# EAGLE design Wobbler-R2 (EAGLE 7.7.0)
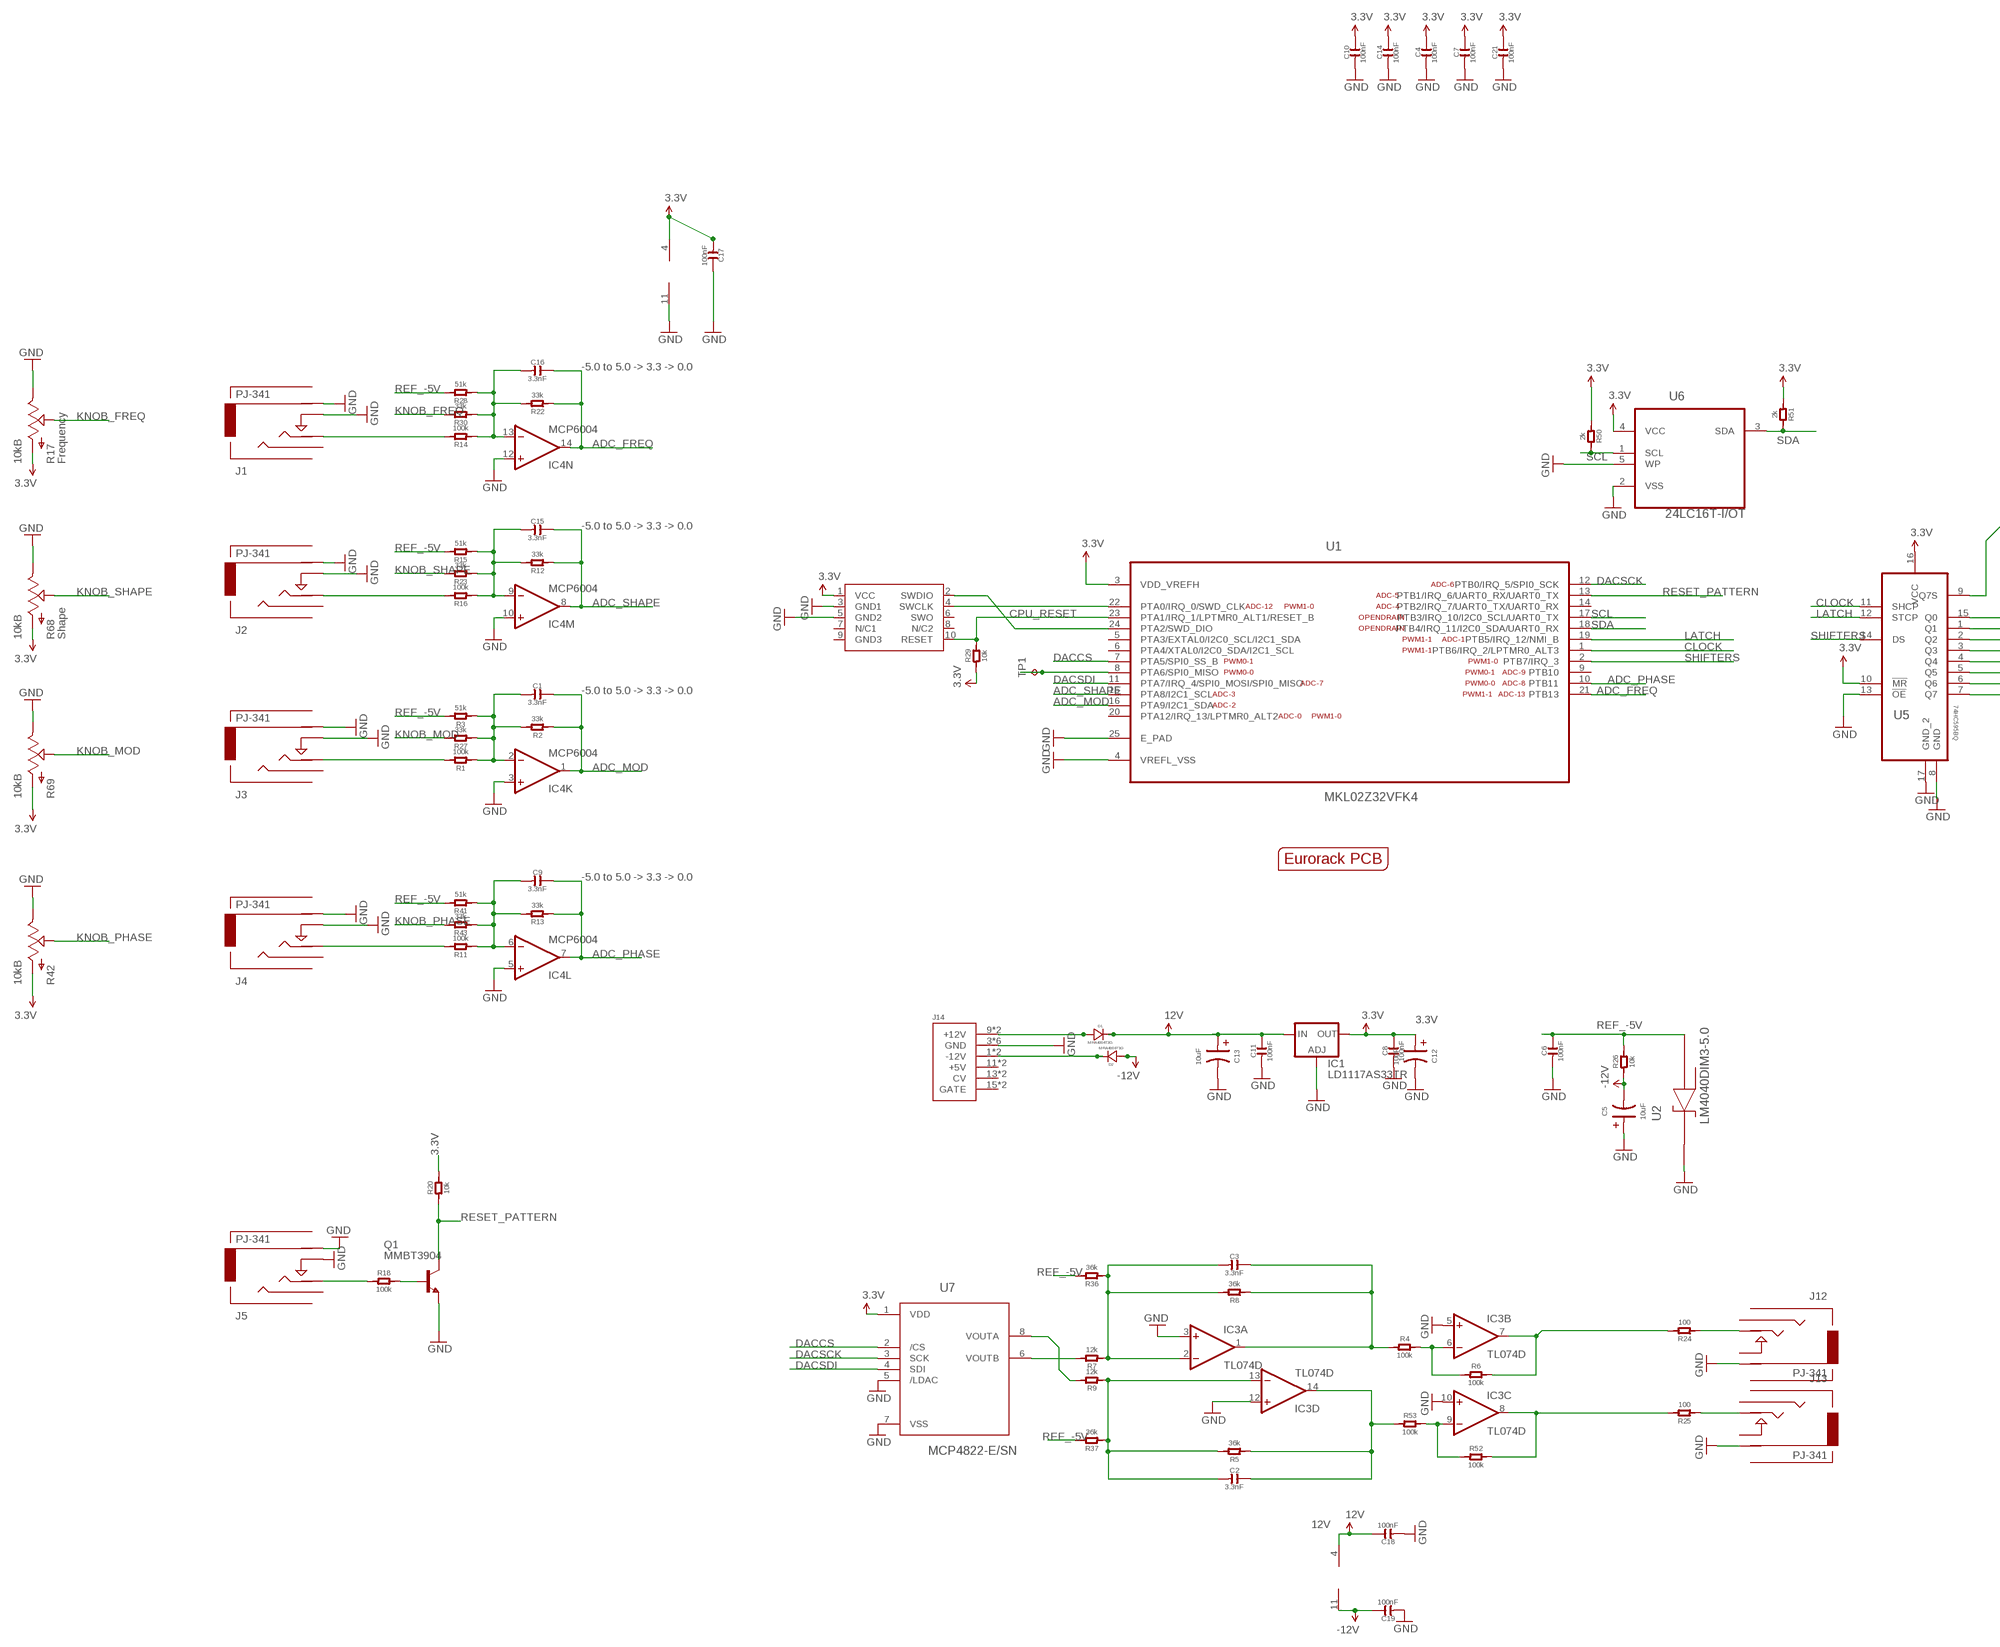
[diagram p0: schematic, sheet 1, part 1 of 2]
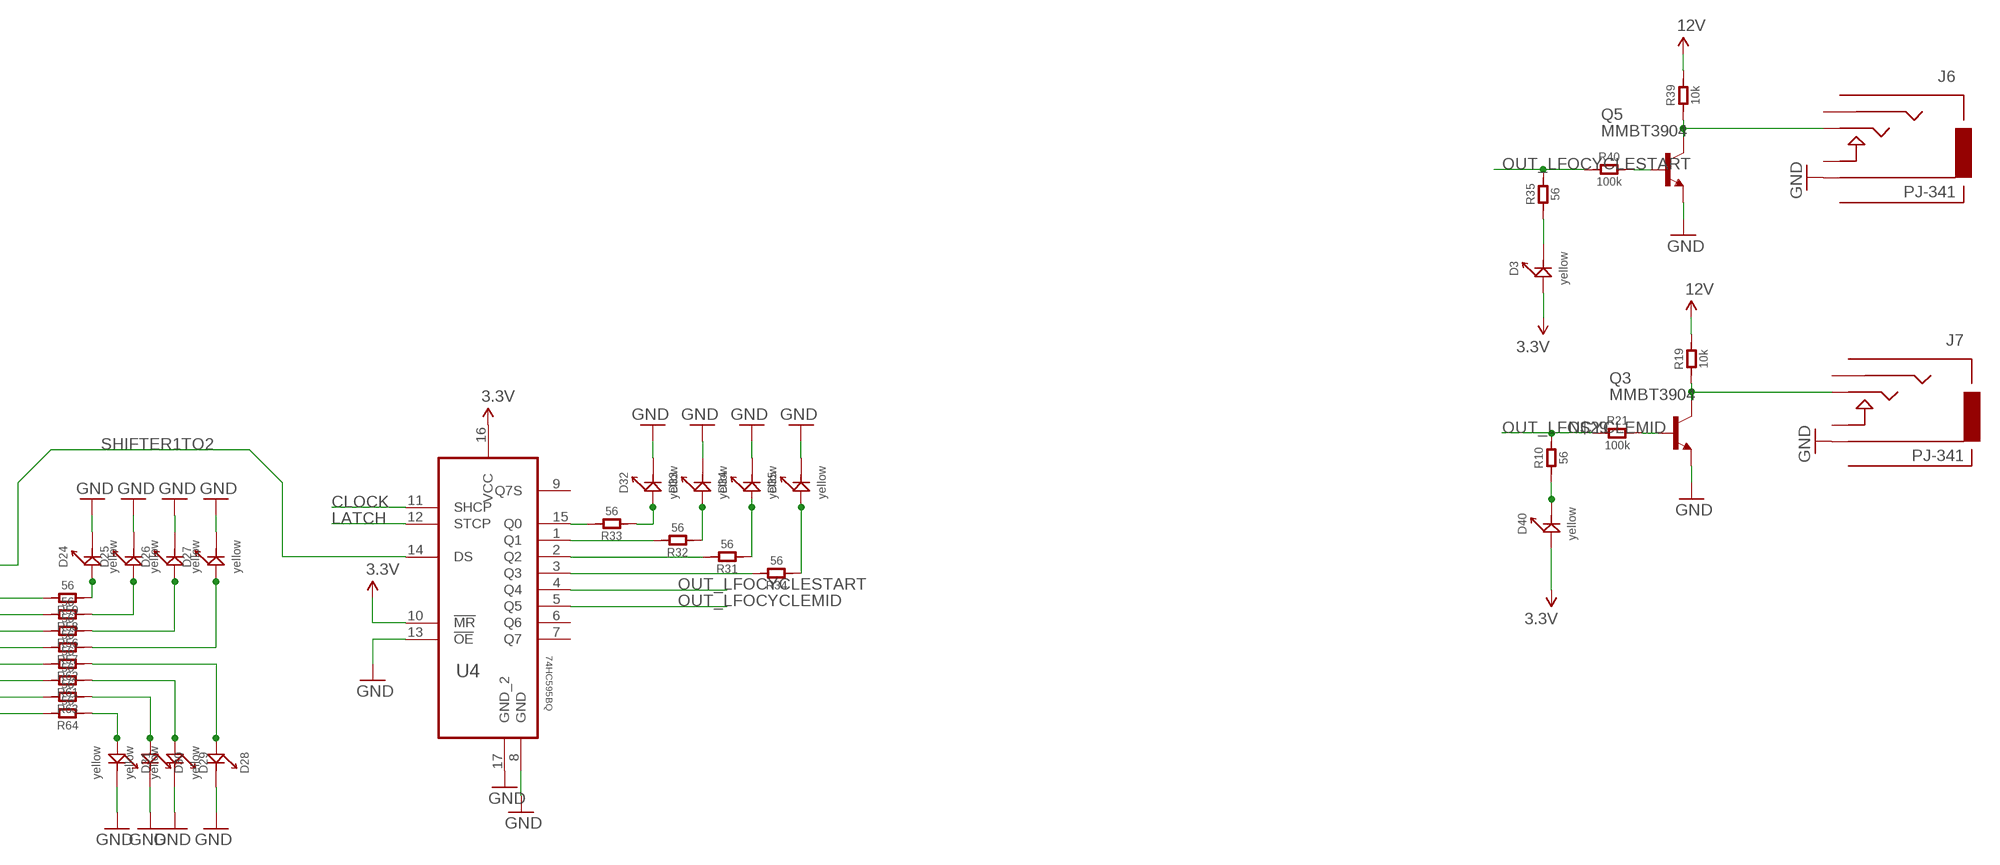
[diagram p1: schematic, sheet 1, part 2 of 2]

## Parts
C1  3.3nF  C-0603  [C0603]
C2  3.3nF  C-0603  [C0603]
C3  3.3nF  C-0603  [C0603]
C4  100nF  C-0603  [C0603]
C5  10uF  C-POLAR-A  [AVX-A]
C6  100nF  C-0603  [C0603]
C7  100nF  C-0603  [C0603]
C8  100nF  C-0603  [C0603]
C9  3.3nF  C-0603  [C0603]
C10  100nF  C-0603  [C0603]
C11  100nF  C-0603  [C0603]
C12  10uF  C-POLAR-A  [AVX-A]
C13  10uF  C-POLAR-A  [AVX-A]
C14  100nF  C-0603  [C0603]
C15  3.3nF  C-0603  [C0603]
C16  3.3nF  C-0603  [C0603]
C17  100nF  C-0603  [C0603]
C18  100nF  C-0603  [C0603]
C19  100nF  C-0603  [C0603]
C21  100nF  C-0603  [C0603]
D1  MRA4004T3G  D-SMA  [DO-214AC]
D2  MRA4004T3G  D-SMA  [DO-214AC]
D3  yellow  LED  [LED0603]
D24  yellow  LED  [LED0603]
D25  yellow  LED  [LED0603]
D26  yellow  LED  [LED0603]
D27  yellow  LED  [LED0603]
D28  yellow  LED  [LED0603]
D29  yellow  LED  [LED0603]
D30  yellow  LED  [LED0603]
D31  yellow  LED  [LED0603]
D32  yellow  LED  [LED0603]
D33  yellow  LED  [LED0603]
D34  yellow  LED  [LED0603]
D35  yellow  LED  [LED0603]
D40  yellow  LED  [LED0603]
IC1  LD1117AS33TR  [SOT223]
IC3  TL074D  [SO14]
IC4  MCP6004  [SO14]
J1  PJ-341  AUDIO-JACKINPUT  [3.5MM-JACK-SWITCH-13MM-INPUT]
J2  PJ-341  AUDIO-JACKINPUT  [3.5MM-JACK-SWITCH-13MM-INPUT]
J3  PJ-341  AUDIO-JACKINPUT  [3.5MM-JACK-SWITCH-13MM-INPUT]
J4  PJ-341  AUDIO-JACKINPUT  [3.5MM-JACK-SWITCH-13MM-INPUT]
J5  PJ-341  AUDIO-JACKINPUT  [3.5MM-JACK-SWITCH-13MM-INPUT]
J6  PJ-341  AUDIO-JACKOUTPUT  [3.5MM-JACK-SWITCH-13MM-OUTPUT]
J7  PJ-341  AUDIO-JACKOUTPUT  [3.5MM-JACK-SWITCH-13MM-OUTPUT]
J12  PJ-341  AUDIO-JACKOUTPUT  [3.5MM-JACK-SWITCH-13MM-OUTPUT]
J13  PJ-341  AUDIO-JACKOUTPUT  [3.5MM-JACK-SWITCH-13MM-OUTPUT]
J14  POWER  [POWER_16]
OUTLINE  EURORACK_PCB8HP  [EURORACK8HPPCB]
Q1  MMBT3904  MMBT3904LT1-NPN-SOT23-BEC  [SOT23-BEC]
Q3  MMBT3904  MMBT3904LT1-NPN-SOT23-BEC  [SOT23-BEC]
Q5  MMBT3904  MMBT3904LT1-NPN-SOT23-BEC  [SOT23-BEC]
R1  100k  R-0603  [R0603]
R2  33k  R-0603  [R0603]
R3  51k  R-0603  [R0603]
R4  100k  R-0603  [R0603]
R5  36k  R-0603  [R0603]
R6  100k  R-0603  [R0603]
R7  12k  R-0603  [R0603]
R8  36k  R-0603  [R0603]
R9  12k  R-0603  [R0603]
R10  56  R-0603  [R0603]
R11  100k  R-0603  [R0603]
R12  33k  R-0603  [R0603]
R13  33k  R-0603  [R0603]
R14  100k  R-0603  [R0603]
R15  51k  R-0603  [R0603]
R16  100k  R-0603  [R0603]
R17  10kB  POTZEPHPOT  [OG-POTS_ALPS_POT_VERTICAL]
R18  100k  R-0603  [R0603]
R19  10k  R-0603  [R0603]
R20  10k  R-0603  [R0603]
R21  100k  R-0603  [R0603]
R22  33k  R-0603  [R0603]
R23  33k  R-0603  [R0603]
R24  100  R-0603  [R0603]
R25  100  R-0603  [R0603]
R26  10k  R-0603  [R0603]
R27  33k  R-0603  [R0603]
R28  51k  R-0603  [R0603]
R29  10k  R-0603  [R0603]
R30  33k  R-0603  [R0603]
R31  56  R-0603  [R0603]
R32  56  R-0603  [R0603]
R33  56  R-0603  [R0603]
R34  56  R-0603  [R0603]
R35  56  R-0603  [R0603]
R36  36k  R-0603  [R0603]
R37  36k  R-0603  [R0603]
R39  10k  R-0603  [R0603]
R40  100k  R-0603  [R0603]
R41  51k  R-0603  [R0603]
R42  10kB  POTZEPHPOT  [OG-POTS_ALPS_POT_VERTICAL]
R43  33k  R-0603  [R0603]
R50  2k  R-0603  [R0603]
R51  2k  R-0603  [R0603]
R52  100k  R-0603  [R0603]
R53  100k  R-0603  [R0603]
R56  56  R-0603  [R0603]
R57  56  R-0603  [R0603]
R58  56  R-0603  [R0603]
R59  56  R-0603  [R0603]
R61  56  R-0603  [R0603]
R62  56  R-0603  [R0603]
R63  56  R-0603  [R0603]
R64  56  R-0603  [R0603]
R68  10kB  POTZEPHPOT  [OG-POTS_ALPS_POT_VERTICAL]
R69  10kB  POTZEPHPOT  [OG-POTS_ALPS_POT_VERTICAL]
SWD1  CORTEX_SWD  [M50-3600542]
TP1  TPB1,27  [B1,27]
U1  MKL02Z32VFK4  [QFN50P400X400X100-25N]
U2  LM4040DIM3-5.0  [SOT95P237X112-3N]
U4  74HC595BQ  [QFN50P250X350X100-17N]
U5  74HC595BQ  [QFN50P250X350X100-17N]
U6  24LC16T-I/OT  24LC00T-I/OT  [SOT95P290X145-5N]
U7  MCP4822-E/SN  [SOIC8-N_MC]

## Nets
3.3V [mediumpower]: C4.2 C7.2 C8.2 C10.2 C12.+ C14.2 C17.1 C21.2 D3.+ D40.+ IC1.2(OUT) IC1.4(OUT) IC4.4(O:V+) R17.P$3(A) R20.2 R29.1 R42.P$3(A) R50.1 R51.1 R68.P$3(A) R69.P$3(A) SWD1.1(VCC) U1.3(VDD_VREFH) U4.10(!MR) U4.16(VCC) U5.10(!MR) U5.16(VCC) U6.4(VCC) U7.1(VDD)
12V [heavypower]: C11.2 C13.+ C18.2 D1.2(-) IC1.3(IN) IC3.4(P:V+) R19.2 R39.2
-12V [heavypower]: C5.- C19.2 D2.1(+) IC3.11(P:V-) R26.1
ADC_FREQ: C16.2 IC4.14(N:OUT) R22.1 U1.21(PTB13)
ADC_MOD: C1.2 IC4.1(K:OUT) R2.1 U1.16(PTA9/I2C1_SDA)
ADC_PHASE: C9.2 IC4.7(L:OUT) R13.1 U1.10(PTB11)
ADC_SHAPE: C15.2 IC4.8(M:OUT) R12.1 U1.15(PTA8/I2C1_SCL)
CLOCK: U1.1(PTB6/IRQ_2/LPTMR0_ALT3) U4.11(SHCP) U5.11(SHCP)
CPU_RESET: R29.2 SWD1.10(RESET) U1.23(PTA1/IRQ_1/LPTMR0_ALT1/RESET_B)
DACCS: U1.7(PTA5/SPI0_SS_B) U7.2(/CS)
DACSCK: U1.12(PTB0/IRQ_5/SPI0_SCK) U7.3(SCK)
DACSDI: U1.11(PTA7/IRQ_4/SPI0_MOSI/SPI0_MISO) U7.4(SDI)
GND [groundplane]: C4.1 C5.+ C6.1 C7.1 C8.1 C10.1 C11.1 C12.- C13.- C14.1 C17.2 C18.1 C19.1 C21.1 D24.- D25.- D26.- D27.- D28.- D29.- D30.- D31.- D32.- D33.- D34.- D35.- IC1.1(ADJ) IC3.3(A:+IN) IC3.5(B:+IN) IC3.10(C:+IN) IC3.12(D:+IN) IC4.3(K:+IN) IC4.5(L:+IN) IC4.10(M:+IN) IC4.11(O:V-) IC4.12(N:+IN) J1.RING@3(RING) J1.SWITCH@3(SWITCH) J2.RING@3(RING) J2.SWITCH@3(SWITCH) J3.RING@3(RING) J3.SWITCH@3(SWITCH) J4.RING@3(RING) J4.SWITCH@3(SWITCH) J5.RING@3(RING) J5.SWITCH@3(SWITCH) J6.RING@3(RING) J7.RING@3(RING) J12.RING@3(RING) J13.RING@3(RING) J14.3(GND) J14.4(GND) J14.5(GND) J14.6(GND) J14.7(GND) J14.8(GND) Q1.E Q3.E Q5.E R17.P$1(E) R42.P$1(E) R68.P$1(E) R69.P$1(E) SWD1.3(GND1) SWD1.5(GND2) U1.4(VREFL_VSS) U1.25(E_PAD) U2.1(CATHODE) U4.8(GND) U4.13(!OE) U4.17(GND_2) U5.8(GND) U5.13(!OE) U5.17(GND_2) U6.2(VSS) U6.5(WP) U7.5(/LDAC) U7.7(VSS)
KNOB_FREQ: R17.P$2(S) R30.2
KNOB_MOD: R27.2 R69.P$2(S)
KNOB_PHASE: R42.P$2(S) R43.2
KNOB_SHAPE: R23.2 R68.P$2(S)
LATCH: U1.19(PTB5/IRQ_12/NMI_B) U4.12(STCP) U5.12(STCP)
N$1: R33.2 U4.15(Q0)
N$2: IC3.6(B:-IN) R4.2 R6.1
N$3: J2.TIP@3(TIP) R16.2
N$4: C15.1 IC4.9(M:-IN) R12.2 R15.1 R16.1 R23.1
N$5: R9.2 U7.8(VOUTA)
N$6: J3.TIP@3(TIP) R1.2
N$7: R7.2 U7.6(VOUTB)
N$8: C1.1 IC4.2(K:-IN) R1.1 R2.2 R3.1 R27.1
N$9: C2.1 IC3.13(D:-IN) R5.2 R9.1 R37.1
N$10: C3.1 IC3.2(A:-IN) R7.1 R8.2 R36.1
N$11: J4.TIP@3(TIP) R11.2
N$12: C9.1 IC4.6(L:-IN) R11.1 R13.2 R41.1 R43.1
N$13 [heavypower]: D1.1(+) J14.9(+12V) J14.10(+12V)
N$14: IC3.7(B:OUT) R6.2 R24.2
N$15: Q1.B R18.2
N$16: J5.TIP@3(TIP) R18.1
N$17: IC3.9(C:-IN) R52.1 R53.2
N$18: C3.2 IC3.1(A:OUT) R4.1 R8.1
N$19: R32.2 U4.1(Q1)
N$20: J13.TIP@3(TIP) R25.1
N$21: J12.TIP@3(TIP) R24.1
N$22: R59.2 U5.15(Q0)
N$23: D40.- R10.1
N$24: C2.2 IC3.14(D:OUT) R5.1 R53.1
N$25: Q3.B R21.2
N$26: R31.2 U4.2(Q2)
N$27: D3.- R35.1
N$28: D28.+ R62.1
N$29: J7.TIP@3(TIP) Q3.C R19.1
N$30: R58.2 U5.1(Q1)
N$31: R56.2 U5.2(Q2)
N$32: D29.+ R61.1
N$33: J1.TIP@3(TIP) R14.2
N$34: C16.1 IC4.13(N:-IN) R14.1 R22.2 R28.1 R30.1
N$35: R57.2 U5.3(Q3)
N$36: R34.2 U4.3(Q3)
N$37: R62.2 U5.4(Q4)
N$38: R61.2 U5.5(Q5)
N$39: R63.2 U5.6(Q6)
N$40: R64.2 U5.7(Q7)
N$60: Q5.B R40.2
N$61: J6.TIP@3(TIP) Q5.C R39.1
N$64 [heavypower]: D2.2(-) J14.1(-12V) J14.2(-12V)
N$73: D27.+ R57.1
N$74: D26.+ R56.1
N$75: D25.+ R58.1
N$76: D24.+ R59.1
N$77: D30.+ R63.1
N$78: D31.+ R64.1
N$79: D32.+ R33.1
N$80: D33.+ R32.1
N$81: D34.+ R31.1
N$82: D35.+ R34.1
N$94: IC3.8(C:OUT) R25.2 R52.2
OUT_LFOCYCLEMID: R10.2 R21.1 U4.5(Q5)
OUT_LFOCYCLESTART: R35.2 R40.1 U4.4(Q4)
PTA6: TP1.TP U1.8(PTA6/SPI0_MISO)
REF_-5V: C6.2 R3.2 R15.2 R26.2 R28.2 R36.2 R37.2 R41.2 U2.2(ANODE)
RESET_PATTERN: Q1.C R20.1 U1.13(PTB1/IRQ_6/UART0_RX/UART0_TX)
SCL: R50.2 U1.17(PTB3/IRQ_10/I2C0_SCL/UART0_TX) U6.1(SCL)
SDA: R51.2 U1.18(PTB4/IRQ_11/I2C0_SDA/UART0_RX) U6.3(SDA)
SHIFTER1TO2: U4.14(DS) U5.9(Q7S)
SHIFTERS: U1.2(PTB7/IRQ_3) U5.14(DS)
SWD_CLK: SWD1.4(SWCLK) U1.22(PTA0/IRQ_0/SWD_CLK)
SWD_DIO: SWD1.2(SWDIO) U1.24(PTA2/SWD_DIO)
Unconnected: J1.SECOND@3(SECOND) J2.SECOND@3(SECOND) J3.SECOND@3(SECOND) J4.SECOND@3(SECOND) J5.SECOND@3(SECOND) J6.SECOND@3(SECOND) J6.SWITCH@3(SWITCH) J7.SECOND@3(SECOND) J7.SWITCH@3(SWITCH) J12.SECOND@3(SECOND) J12.SWITCH@3(SWITCH) J13.SECOND@3(SECOND) J13.SWITCH@3(SWITCH) J14.11(+5V) J14.12(+5V) J14.13(CV) J14.14(CV) J14.15(GATE) J14.16(GATE) SWD1.6(SWO) SWD1.7(N/C1) SWD1.8(N/C2) SWD1.9(GND3) U1.5(PTA3/EXTAL0/I2C0_SCL/I2C1_SDA) U1.6(PTA4/XTAL0/I2C0_SDA/I2C1_SCL) U1.9(PTB10) U1.14(PTB2/IRQ_7/UART0_TX/UART0_RX) U1.20(PTA12/IRQ_13/LPTMR0_ALT2) U2.3(NC) U4.6(Q6) U4.7(Q7) U4.9(Q7S)

## Notes on the sheet
- -5.0 to 5.0 -> 3.3 -> 0.0
- -5.0 to 5.0 -> 3.3 -> 0.0
- -5.0 to 5.0 -> 3.3 -> 0.0
- -5.0 to 5.0 -> 3.3 -> 0.0

## Library data of the parts
C1-C3 C9 C15 C16 = OPL:C*; OC_FARNELL: unknown
C4 C7 C8 C10 C11 C14 C17-C19 C21 = OPL:C*; MF: MULTICOMP; MPN: MC0603F104Z160CT; OC_FARNELL: 1759017
C5 C12 C13 = OPL:C-POLAR*; MF: AVX; MPN: TAJB106K020RNJ; OC_FARNELL: 197427
C6 = OPL:C*; MF: AVX; MPN: 06035C104KAT2A; OC_FARNELL: 1301804
D1 D2 = OPL:D*: DIODE; MF: VISHAY; MPN: US1G-E3/5AT; OC_FARNELL: 9551824
D3 D24-D35 D40 = OPL:LED*: LED
IC1 = ld-components:LD1117A?*: Low drop fixed and adjustable positive voltage regulators 1 A Source: http://www.st.com/stonline/products/literature/ds/7194/ld1117axx.pdf; MF: STMICROELECTRONICS; MPN: LD1117AS33TR; OC_FARNELL: 1467776
IC3 = EurorackModularParts:TL074: OP AMP; MF: TEXAS INSTRUMENTS; MPN: TL074CD; OC_FARNELL: 1103010
IC4 = EurorackModularParts:MCP6004; MF: MICROCHIP; MPN: MCP6004-I/SL.; OC_FARNELL: 1605572
J1 = EurorackModularParts:AUDIO-JACK: Switching Mono 3.5mm Audio Jack from Erthenvar.; DESC: Frequency; OC_FARNELL: unknown
J2 = EurorackModularParts:AUDIO-JACK: Switching Mono 3.5mm Audio Jack from Erthenvar.; DESC: Shape; OC_FARNELL: unknown
J3 = EurorackModularParts:AUDIO-JACK: Switching Mono 3.5mm Audio Jack from Erthenvar.; DESC: Mod; OC_FARNELL: unknown
J4 = EurorackModularParts:AUDIO-JACK: Switching Mono 3.5mm Audio Jack from Erthenvar.; DESC: Phase; OC_FARNELL: unknown
J5 = EurorackModularParts:AUDIO-JACK: Switching Mono 3.5mm Audio Jack from Erthenvar.; DESC: Reset; OC_FARNELL: unknown
J6 = EurorackModularParts:AUDIO-JACK: Switching Mono 3.5mm Audio Jack from Erthenvar.; DESC: Loop; OC_FARNELL: unknown
J7 = EurorackModularParts:AUDIO-JACK: Switching Mono 3.5mm Audio Jack from Erthenvar.; DESC: Mid; OC_FARNELL: unknown
J12 = EurorackModularParts:AUDIO-JACK: Switching Mono 3.5mm Audio Jack from Erthenvar.; DESC: Out 2; OC_FARNELL: unknown
J13 = EurorackModularParts:AUDIO-JACK: Switching Mono 3.5mm Audio Jack from Erthenvar.; DESC: Out 1; OC_FARNELL: unknown
J14 = eurorack:POWER; OC_FARNELL: unknown
OUTLINE = EurorackModularParts:EURORACK_PCB; OC_FARNELL: unknown
Q1 Q3 Q5 = transistor:*-NPN-: NPN Transistror BF959 corrected 2008.03.06; MF: NXP; MPN: PMBT3904,215; OC_FARNELL: 2336795
R1-R16 R18-R37 R39-R41 R43 R50-R53 R56-R59 R61-R64 = OPL:R*; OC_FARNELL: unknown
R17 = EurorackModularParts:POT; DESC: Frequency; OC_FARNELL: unknown
R42 = EurorackModularParts:POT; DESC: Phase; OC_FARNELL: unknown
R68 = EurorackModularParts:POT; DESC: Shape; OC_FARNELL: unknown
R69 = EurorackModularParts:POT; DESC: Mod; OC_FARNELL: unknown
SWD1 = carrilib with jtags:CORTEX_SWD: .05" Cortex M Connector in SWD mode Manufacturer: Generic Part Number: Cortex M SWD Notes: I use Harwin M50-3600542 connectors; OC_FARNELL: unknown
TP1 = testpad:TP: Test pad; OC_FARNELL: unknown
U1 = FarnellThings:MKL02Z32VFK4: IC, MCU, 32BIT, CORTEX M0+, 48MHZ, QFN-24; MF: NXP; MPN: MKL02Z32VFK4; OC_FARNELL: 2321481; OC_NEWARK: 61W9887; PACKAGE: QFN-24; SUPPLIER: FREESCALE SEMICONDUCTOR
U2 = FarnellThings:LM4040DIM3-5.0: IC, Precision Micropower Shunt Voltage Reference, 5V,SOT-23-3; MF: TEXAS INSTRUMENTS; MPN: LM4040DIM3-5.0; OC_FARNELL: 9778330; OC_NEWARK: 97K3489; PACKAGE: SOT-23-3; SUPPLIER: TEXAS INSTRUMENTS
U4 U5 = FarnellThings:74HC595BQ: 8-bit serial-in, serial or parallel-out shift register,QFN-16; MF: NXP; MPN: 74HC595BQ; OC_FARNELL: 2164850; OC_NEWARK: 43W8000; PACKAGE: QFN-16; SUPPLIER: NXP
U6 = EurorackModularParts:24LC00T-I/OT: IC, EEPROM 128BIT SERIAL 400KHZ SOT-23-5; MF: MICROCHIP; MPN: 24LC00T-I/OT; OC_FARNELL: 9757864; OC_NEWARK: 62K0574; PACKAGE: SOT-23-5; SUPPLIER: MICROCHIP
U7 = FarnellThings:MCP4822-E/SN: 12 Bit DAC; DESCRIPTION: 12 Bit DAC; MF: MICROCHIP; MPN: MCP4822-E/SN; OC_FARNELL: 1439414; OC_NEWARK: 31K2975; PACKAGE: SOIC-8; SUPPLIER: Microchip

## Net classes
0 default: width 0.203 mm, clearance 0.178 mm
1 heavypower: width 0.381 mm
2 mediumpower: width 0.254 mm
3 groundplane: width 0.254 mm, clearance 0.203 mm

## Board
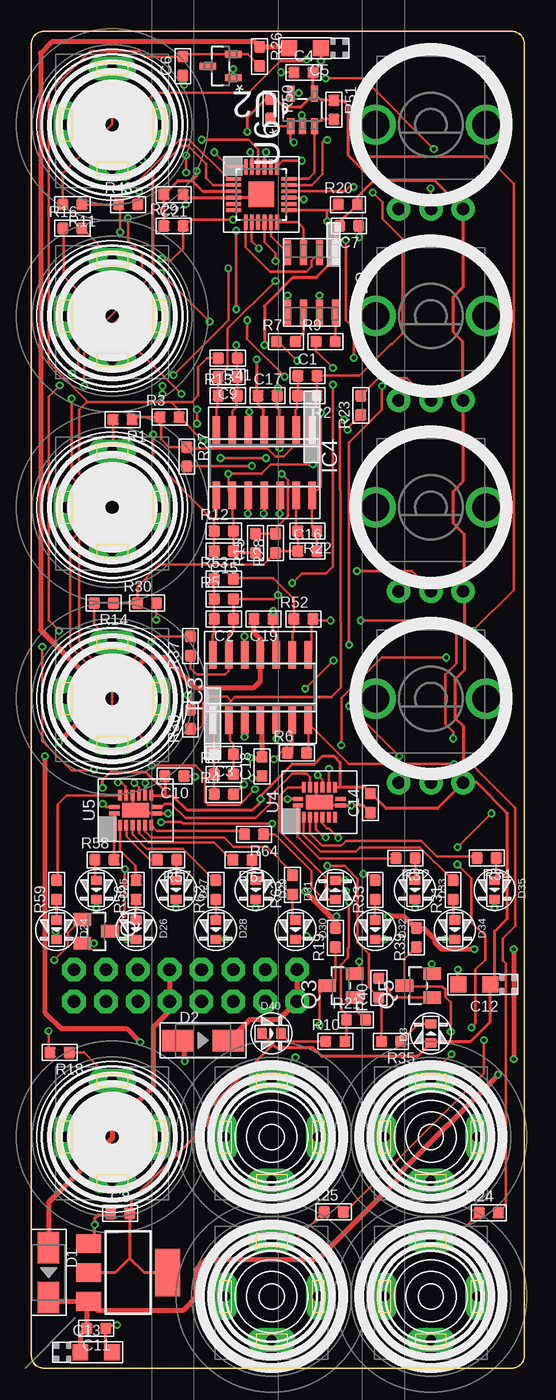
[diagram p2: board, top side]
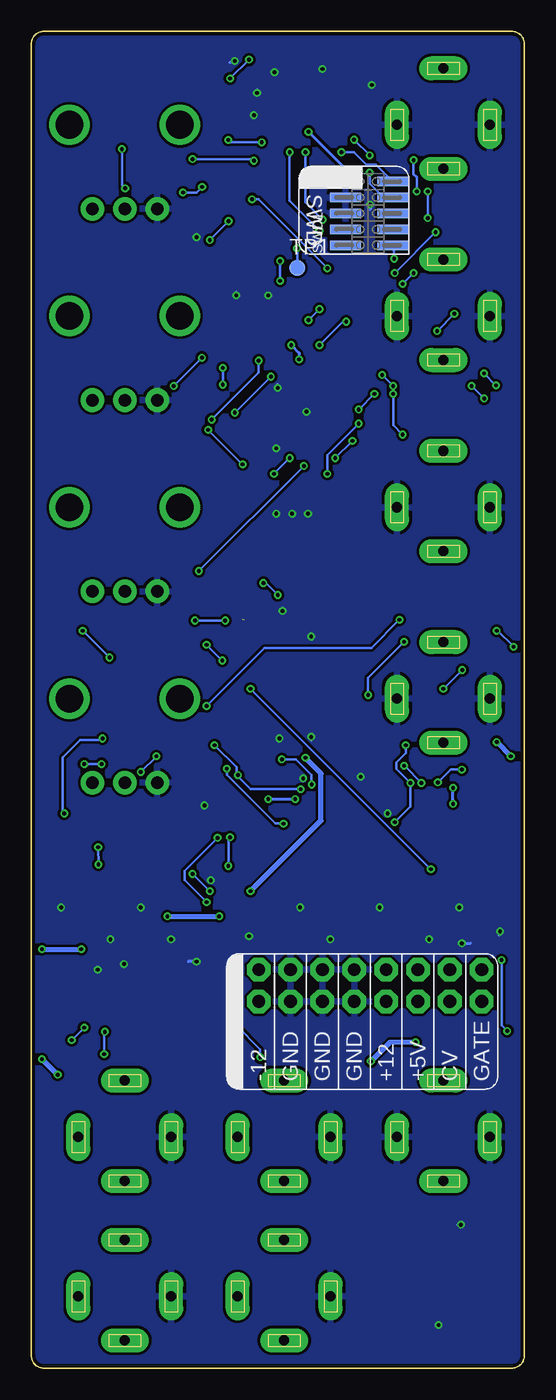
[diagram p3: board, bottom side, seen from below]

Size 39.3 x 106.5 mm. Coordinates in mm from the lower left corner, seen from the top.
Copper layers (1*16): Top 0.035mm / dielectric 1.5mm / Bottom 0.035mm
Design rules "dirt_cheap_dirty_boards.v1": minimum track width 5mil, minimum drill 12mil, track to track 5mil, track to pad 5mil, pad to pad 5mil, via to via 5mil, smd to smd 0mil, copper to edge 10mil, drill to drill 10mil, minimum pad ring 10mil, minimum via ring 6mil, stop-mask expansion 2mil, vias tented up to drill 25mil, thermal gap 10mil

### Footprints (pad centres in the part's own frame; a part is rotated, then mirrored left to right if it is on the bottom)
C0603 = smd 0.889 x 0.889: 1 -0.762,0; 2 0.762,0
AVX-A = smd 1.27 x 1.27: + -1.27,0; - 1.27,0
DO-214AC = smd 2.5 x 1.7: 1 -2,0; 2 2,0
LED0603 = smd 0.762 x 0.889: + -0.762,0; - 0.762,0
SOT223 = smd 1.5 x 2: 1 -2.3,-3.15; 2 0,-3.15; 3 2.3,-3.15 | smd 3.8 x 2: 4 0,3.15
SO14 = smd 0.6 x 2.2: 1 -3.81,-2.6; 2 -2.54,-2.6; 3 -1.27,-2.6; 4 0,-2.6; 5 1.27,-2.6; 6 2.54,-2.6; 7 3.81,-2.6; 8 3.81,2.6; 9 2.54,2.6; 10 1.27,2.6; 11 0,2.6; 12 -1.27,2.6; 13 -2.54,2.6; 14 -3.81,2.6
3.5MM-JACK-SWITCH-13MM-INPUT = drill 0.8 pad 1.93 long: RING@3 -3.7,0; SECOND@3 0,-3.5; SWITCH@3 3.7,0; TIP@3 0,4.5
3.5MM-JACK-SWITCH-13MM-OUTPUT = drill 0.8 pad 1.93 long: RING@3 -3.7,0; SECOND@3 0,-3.5; SWITCH@3 3.7,0; TIP@3 0,4.5
POWER_16 = drill 1.016 pad 1.88 octagon: 1 -6.35,-1.27; 2 -6.35,1.27; 3 -3.81,-1.27; 4 -3.81,1.27; 5 -1.27,-1.27; 6 -1.27,1.27; 7 1.27,-1.27; 8 1.27,1.27; 9 3.81,-1.27; 10 3.81,1.27; 11 6.35,-1.27; 12 6.35,1.27; 13 8.89,-1.27; 14 8.89,1.27; 15 11.43,-1.27; 16 11.43,1.27
SOT23-BEC = smd 1 x 1.4: B -0.95,-1.1; C 0,1.1; E 0.95,-1.1
R0603 = smd 0.889 x 0.889: 1 -0.762,0; 2 0.762,0
OG-POTS_ALPS_POT_VERTICAL = drill 1 pad 1.88: P$1 -2.58,-6.7; P$2 0,-6.7; P$3 2.58,-6.7 | drill 2.2 pad 3.175: P$4 4.4,0; P$5 -4.4,0
M50-3600542 = smd 0.75 x 2.5: 1 -2.54,-1.81; 2 -2.54,2; 3 -1.27,-1.81; 4 -1.27,2; 5 0,-1.81; 6 0,2; 7 1.27,-1.81; 8 1.27,2; 9 2.54,-1.81; 10 2.54,2
B1,27 = smd 1.27 x 1.27: TP 0,0
QFN50P400X400X100-25N = smd 1.2 x 0.3: 1 -2.2,1.245; 2 -2.2,0.762; 3 -2.2,0.254; 4 -2.2,-0.254; 5 -2.2,-0.762; 6 -2.2,-1.245; 13 2.2,-1.245; 14 2.2,-0.762; 15 2.2,-0.254; 16 2.2,0.254; 17 2.2,0.762; 18 2.2,1.245 | smd 0.3 x 1.2: 7 -1.245,-2.2; 8 -0.762,-2.2; 9 -0.254,-2.2; 10 0.254,-2.2; 11 0.762,-2.2; 12 1.245,-2.2; 19 1.245,2.2; 20 0.762,2.2; 21 0.254,2.2; 22 -0.254,2.2 | smd 0.305 x 1.2: 23 -0.762,2.2; 24 -1.245,2.2 | smd 2.032 x 2.032: 25 0,0
SOT95P237X112-3N = smd 1.321 x 0.559: 1 -1.016,0.94; 2 -1.016,-0.94; 3 1.016,0
QFN50P250X350X100-17N = smd 0.305 x 0.813: 1 -0.254,1.702; 8 -0.254,-1.702; 9 0.254,-1.702; 16 0.254,1.702 | smd 0.813 x 0.305: 2 -1.194,1.245; 3 -1.194,0.762; 4 -1.194,0.254; 5 -1.194,-0.254; 6 -1.194,-0.762; 7 -1.194,-1.245; 10 1.194,-1.245; 11 1.194,-0.762; 12 1.194,-0.254; 13 1.194,0.254; 14 1.194,0.762; 15 1.194,1.245 | smd 1.143 x 2.159: 17 0,0
SOT95P290X145-5N = smd 1.27 x 0.559: 1 -1.295,0.94; 2 -1.295,0; 3 -1.295,-0.94; 4 1.295,-0.94; 5 1.295,0.94
SOIC8-N_MC = smd 1.981 x 0.559: 1 -2.362,1.905; 2 -2.362,0.635; 3 -2.362,-0.635; 4 -2.362,-1.905; 5 2.362,-1.905; 6 2.362,-0.635; 7 2.362,0.635; 8 2.362,1.905

### Placement (x,y rotation side)
C1  22.01,79.06 0 top
C2  15.34,59.69 180 top
C3  15.34,48.9 180 top
C4  21.7,103.22 0 top
C5  21.82,105.16 180 top
C6  12.08,103.74 90 top
C7  25.33,91 180 top
C8  7.08,12.32 0 top
C9  15.64,78.97 180 top
C10  11.41,47.17 180 top
C11  5.18,3.17 180 top
C12  35.3,30.57 180 top
C13  5.18,1.27 0 top
C14  27.02,45.02 90 top
C15  15.34,65.09 180 top
C16  22.01,65.09 0 top
C17  18.83,77.47 0 top
C18  18.39,47.94 90 top
C19  18.52,59.69 180 top
C21  11.33,93.5 180 top
D1  1.37,7.62 270 top
D2  13.69,26.1 0 top
D3  31.85,26.67 90 top
D24  2,34.92 270 top
D25  5.18,38.1 270 top
D26  8.36,34.92 270 top
D27  11.53,38.1 270 top
D28  14.71,34.92 270 top
D29  17.88,38.1 270 top
D30  21.05,34.92 270 top
D31  24.23,38.1 90 top
D32  27.41,34.92 270 top
D33  30.58,38.1 270 top
D34  33.75,34.92 270 top
D35  36.93,38.1 270 top
D40  19.15,26.67 0 top
IC1  7.72,7.62 270 top
IC3  18.27,54.23 0 top
IC4  18.57,72.13 180 top
J1  6.45,53.34 0 top
J2  6.45,83.82 0 top
J3  6.45,68.58 0 top
J4  6.45,99.06 0 top
J5  6.45,18.41 0 top
J6  31.85,18.41 0 top
J7  19.15,18.41 0 top
J12  31.85,5.71 0 top
J13  19.15,5.71 0 top
J14  14.83,30.48 0 bottom
OUTLINE  -0.5,0 0 top
Q1  5.18,34.8 270 top
Q3  24.67,30.48 90 top
Q5  30.83,30.48 90 top
R1  7.28,75.56 180 top
R2  22.01,77.47 180 top
R3  11.02,75.77 0 top
R4  15.34,45.72 0 top
R5  15.34,61.28 0 top
R6  21.18,49.02 0 top
R7  20.28,81.78 0 top
R8  15.34,47.31 0 top
R9  23.46,81.78 0 top
R10  24.23,26.04 0 top
R11  3.28,92.71 180 top
R12  15.34,66.67 0 top
R13  15.66,77.47 0 top
R14  5.78,60.96 180 top
R15  17.88,65.72 90 top
R16  3.28,90.81 0 top
R17  31.85,53.34 0 top
R18  2.26,25.15 180 top
R19  24.23,34.29 90 top
R20  25.23,92.71 0 top
R21  25.88,27.75 0 top
R22  22.01,66.67 180 top
R23  26.26,76.71 90 top
R24  36.46,12.38 0 top
R25  24.1,12.45 0 top
R26  18.2,104.5 270 top
R27  12.39,72.61 270 top
R28  19.47,65.72 90 top
R29  11.33,91 0 top
R30  9.22,60.96 0 top
R31  33.62,38.1 90 top
R32  29.83,40.63 180 top
R33  27.41,38.1 90 top
R34  36.3,40.64 180 top
R35  28.67,26.04 180 top
R36  12.67,51.69 90 top
R37  12.67,57.53 90 top
R39  30.69,34.3 90 top
R40  27.69,30.29 90 top
R41  15.66,80.45 180 top
R42  31.85,99.06 0 top
R43  7.72,92.71 0 top
R50  19.08,100.34 270 top
R51  24.12,100.25 270 top
R52  21.69,59.69 0 top
R53  15.34,62.87 0 top
R56  8.36,38.1 90 top
R57  10.83,40.5 180 top
R58  5.83,40.5 0 top
R59  2,38.1 90 top
R61  16.83,40.5 180 top
R62  14.71,38.1 90 top
R63  20.83,38.5 90 top
R64  17.74,42.53 180 top
R68  31.85,83.82 0 top
R69  31.85,68.58 0 top
SWD1  12.46,92 270 bottom
TP1  18.1,87.67 0 bottom
U1  18.33,93.5 0 top
U2  15.08,103.74 180 top
U4  22.96,45.09 90 top
U5  8.31,44.45 90 top
U6  21.62,100.25 90 top
U7  22.33,86.5 270 top

### Tracks (layer width: path | path; a pad name or v marks a point on that pad's centre or on a via)
3.3V  (via drill 0.3)
  Top 0.254: U6.4 23.09,101.01 R51.1 24.16,100.97 24.87,100.97 25.25,100.58 25.25,96.65 27.28,94.61 | IC4.4 18.52,74.78 18.52,76.33 18.07,76.77 C17.1 17.95,77.5 v17.95,80.38 | R17.P$3 34.43,51.14 33.75,51.82 33.75,54.86 34.52,55.63 34.52,61.79 R69.P$3 34.52,61.97 34.52,66.42 33.63,67.31 33.63,69.85 34.43,70.65 R68.P$3 34.39,77.16 34.39,81.79 33.63,82.55 33.63,85.34 34.43,86.15 R42.P$3 32.17,94.61 27.28,94.61 | 27.28,94.61 25.99,93.33 R20.2 24.57,91.29 C7.2 24.23,90.67 U7.1 24.2,88.75 24.2,88.38 22.7,86.88 20.83,86.88 18.58,84.62 v18.58,81.5 | 12.8,94.61 11.68,94.61 C21.2 R29.1 | 12.8,94.61 13.66,93.75 U1.3 | 12.8,94.61 13.18,95 v13.18,95.38 | U6.4 21.47,100.46 20.17,100.46 19.52,101.1 R50.1 18.95,101.12 18.7,101.12 17.2,99.62 v17.2,98.5 | U6.4 22.46,101.64 C4.2 | U4.16 v20.42,45.34 | 10.64,45.59 9.61,45.59 U5.10 | U5.16 5.94,44.7 v5.69,44.96 | v5.69,46.23 5.69,46.86 6.32,47.5 9.12,47.5 10.64,45.97 | 10.64,45.59 11.28,45.59 12.42,44.45 17.63,44.45 18.26,45.09 v18.26,45.34 18.26,45.59 20.8,48.13 22.58,48.13 23.21,48.77 24.1,48.77 24.61,48.26 24.61,46.41 24.74,46.28 | R17.P$3 32.37,44.58 28.29,44.58 26.8,46.07 | 26.8,46.07 26.59,46.28 24.74,46.28 | 24.74,46.28 U4.10 | 10.46,47.17 C10.2 10.64,45.97 | 10.64,45.97 10.64,45.59 | C14.2 26.8,46.01 26.8,46.07 | 19.26,25.8 19.53,25.53 22.45,25.53 23.15,24.83 30.77,24.83 D3.+ 31.98,26.04 35.02,26.04 36.57,27.58 C12.+ 36.93,30.93 36.93,34.8 37.95,35.81 37.95,44.2 35.5,46.64 R17.P$3 | 19.26,25.8 D40.+ | 7.85,8.76 C8.2 7.96,12.38 7.96,13.38 14.08,19.5 14.08,20.62 19.26,25.8 | 7.85,8.76 8.99,7.62 IC1.4 | IC1.2 6.7,7.62 7.85,8.76
  Bottom 0.254: v13.18,95.38 13.63,94.93 | 13.63,94.93 14.02,94.54 SWD1.1 | v20.42,45.34 v18.26,45.34 | v5.69,44.96 v5.69,46.23 | v17.95,80.38 17.95,80.88 v18.58,81.5 | v17.2,98.5 13.63,94.93
12V  (via drill 0.3)
  Top 0.381: IC3.4 18.33,51.56 18.33,50 18.39,49.94 C18.2 18.2,48.62 v17.45,48.62 | v24.33,36 24.33,35.62 | 24.33,35.62 24.33,35.12 R19.2 | v28.45,36 29.7,36 30.58,35.12 R39.2 30.83,35 31.33,35 32.2,34.12 32.2,33.88 32.7,33.38 v35.32,33.38 | v21.83,38 24.2,35.62 24.33,35.62 | D1.2 1.67,5.32 IC1.3 | IC1.3 4.42,5.17 C11.2 3.91,2.67 C13.+ | v38.45,33.38 v38.45,24.62 | 4.71,5.38 IC1.3 | IC1.3 5.32,4.57 12.04,4.57 13.18,5.71 13.18,7.87 13.93,8.62 22.82,8.62 29.18,14.99 29.18,15.35 v37.2,23.38
  Bottom 0.381: v28.45,36 v24.33,36 | v17.45,48.62 16.2,47.38 16.2,43.62 v21.83,38 | v38.45,33.38 v35.32,33.38 | v38.45,24.62 v37.2,23.38
-12V  (via drill 0.3)
  Top 0.381: C5.- 19.81,105.26 R26.1 17.8,105.66 1.62,105.66 0.74,104.78 0.74,58.81 4.67,54.87 | C19.2 17.75,58.58 18.33,58 18.33,56.89 IC3.11 18.33,56.88 18.26,56.88 | 4.67,54.87 7.47,54.87 9.24,56.64 10.64,56.64 13.05,54.23 17.75,54.23 18.26,54.74 18.26,56.88 | 18.26,56.88 18.26,57.15 18.39,57.28 | v1.08,48.75 1.08,28.36 2.39,27.05 7.59,27.05 v8.67,25.97 | v2.21,49.88 4.58,52.25 4.58,54.88 4.67,54.87 | v12.23,24.45 12.23,25.56 D2.1
  Bottom 0.381: v2.21,49.88 v1.08,48.75 | v8.67,25.97 10.7,25.97 v12.23,24.45
ADC_FREQ  (via drill 0.3)
  Top 0.203: C16.2 R22.1 22.38,67.07 IC4.14 22.45,69.62 23.08,70.25 v23.08,76.12 | v18.7,96.88 18.58,96.75 18.58,95.75 U1.21 | v16.33,84.38 v16.33,90.62 | v17.2,83.5 17.2,82 v20.2,79
  Bottom 0.203: v18.7,96.88 18.7,93 v16.33,90.62 | v17.2,83.5 v16.33,84.38 | v23.08,76.12 v20.2,79
ADC_MOD  (via drill 0.3)
  Top 0.203: IC4.1 22.38,76.38 22.71,76.71 22.71,77.41 R2.1 C1.2 26.13,79.06 28.67,81.6 28.74,81.6 29.56,82.42 29.56,89.98 27.98,91.57 27.98,92.9 v27.21,93.66 | v25.69,94.11 25.37,94.11 25.02,93.75 U1.16
  Bottom 0.203: v27.21,93.66 26.13,93.66 v25.69,94.11
ADC_PHASE  (via drill 0.3)
  Top 0.203: IC4.7 14.76,76.51 14.83,76.58 14.83,77.41 R13.1 14.9,78.96 C9.2 15.66,79.75 15.66,82.8 v19.47,86.61 | U1.10 18.58,89.72 19.47,88.84 v19.47,88.2
  Bottom 0.203: v19.47,88.2 v19.47,86.61
ADC_SHAPE  (via drill 0.3)
  Top 0.203: 14.58,67.5 R12.1 C15.2 | 14.58,67.5 14.58,67.69 14.76,67.87 IC4.8 | v21.7,93.12 21.58,93.25 20.58,93.25 U1.15 | v15.71,87.62 15.71,83.5 v11.33,79.12 | v10.46,77.62 v10.46,78.25 | v9.71,74.38 9.71,72.38 14.58,67.5
  Bottom 0.203: v21.7,93.12 21.2,93.12 v15.71,87.62 | v10.46,78.25 v11.33,79.12 | v10.46,77.62 10.46,75.12 v9.71,74.38
CLOCK  (via drill 0.3)
  Top 0.203: U4.11 v23.72,47.75 | v9.08,46.62 9.08,45.75 U5.11 | v10.33,43.5 11.96,43.5 12.08,43.38 v19.2,43.38 | v7.71,93.75 11.83,97.88 12.58,97.88 15.71,94.75 16.08,94.75 U1.1 | v7.71,91.62 7.71,89.88 8.83,88.75 v8.83,87.25 | v9.71,86.38 4.21,80.88 v4.21,78.25 | v3.21,77.25 3.21,71 4.21,70 4.21,67 3.08,65.88 3.08,57.5 v4.96,55.62 | v6.46,54.12 6.46,52.62 v9.46,49.62
  Bottom 0.203: v10.33,43.5 9.08,44.75 v9.08,46.62 10.21,47.75 10.21,48.25 9.46,49 v9.46,49.62 | v19.2,43.38 19.83,43.38 23.7,47.25 23.7,47.75 v23.72,47.75 | v7.71,91.62 v7.71,93.75 | v9.71,86.38 v8.83,87.25 | v3.21,77.25 v4.21,78.25 | v6.46,54.12 v4.96,55.62
CPU_RESET  (via drill 0.3)
  Top 0.203: v10.39,88.39 10.51,88.27 11.15,88.27 12.09,89.21 R29.2 12.21,91 12.71,91.5 v16.08,91.5 | v17.45,96.88 17.58,96.75 17.58,95.75 U1.23
  Bottom 0.203: SWD1.10 10.39,89.4 v10.39,88.39 | v17.45,96.88 17.45,92.88 v16.08,91.5
DACCS
  Top 0.203: U7.2 22.33,88.22 22.33,87.76 21.94,87.38 19.02,87.38 17.09,89.31 U1.7
DACSCK
  Top 0.203: U7.3 21.69,90.81 21.2,91.3 U1.12
DACSDI
  Top 0.203: U7.4 19.09,90.19 U1.11
GND  (via drill 0.3)
  Top 0.254: C6.1 12.25,102.8 12.25,102.32 v12.17,102.23 | IC3.10 19.53,58.42 19.28,58.67 C19.1 v19.28,60.33 | IC4.5 17.37,74.81 v17.37,76.2 | v19.66,78.11 19.66,77.53 C17.2 19.59,76.52 19.78,76.33 19.78,74.78 IC4.3 19.84,73.33 v19.78,73.28 | IC3.12 v16.99,58.29 | IC3.3 v16.99,50.29 | IC3.5 v19.53,50.16 | C18.1 v17.63,46.99 | D24.- v1.94,34.8 | D25.- v5.18,36.7 | D26.- v7.59,34.16 | D27.- v11.53,36.7 | D28.- v15.47,34.16 | D29.- v17.88,36.7 | D30.- 21.18,34.29 21.69,34.29 21.82,34.42 v21.94,34.42 | D31.- v24.99,38.86 | D32.- v28.17,34.16 | D33.- v30.58,36.7 | D34.- v32.99,34.16 | D35.- v36.93,36.7 | C12.- 34.01,30.59 v34.01,31.75 | Q1.E 4.12,33.91 v4.99,33.85 | U2.1 16.09,103.13 v16.1,103.5 | C4.1 20.16,103.26 v19.91,103.25 | U6.5 21.25,101.54 v21.31,101.6 | U6.2 21.62,99.77 v21.56,99.82 | C5.+ v23.09,104.14 | C7.1 26.15,91.06 v26.13,90.11 | U1.25 18.08,93.25 U1.4 12.32,93.25 12.29,93.22 | C21.1 12.17,93.43 12.29,93.22 | 12.29,93.22 v12.29,92.71 | U7.7 v22.97,85.47 v22.96,85.47 | U7.5 20.42,85.34 v20.42,85.47 | IC4.10 17.3,68.12 v17.24,68.07 | IC4.11 18.57,68.12 v18.52,68.07 | IC4.12 19.84,68.12 v19.78,68.07 | C10.1 13,47.17 v13.05,47.12 | U4.13 22.71,45.34 U4.17 23.21,44.83 U4.8 v25.5,44.83 26.45,44.83 C14.1 | U5.13 8.06,44.7 U5.17 8.57,44.2 U5.8 v10.89,44.2 | Q3.E 26.13,31.6 v26.13,32.38 | Q5.E 31.93,32.17 v31.91,32.19 | C13.- 5.94,1.78 C11.1 6.2,3.43 v6.83,3.43 | IC1.1 5.05,10.4 v5.05,11.43 5.05,11.94 5.31,12.19 6.19,12.19 C8.1
  Bottom 0.254: v17.37,76.2 17.37,76.33 | v19.66,78.11 19.66,78.36 | v19.28,60.33 19.28,60.58 | v16.99,58.29 16.99,58.55 | v16.99,50.29 16.99,50.04 | v19.53,50.16 19.53,50.04 | v1.94,34.8 2,34.48 | v5.18,36.7 5.18,36.58 | v7.59,34.16 7.47,34.16 | v11.53,36.7 11.53,36.45 | v15.47,34.16 15.47,34.29 | v17.88,36.7 17.88,36.45 | v21.94,34.42 22.07,34.42 | v28.17,34.16 28.29,34.29 | v30.58,36.7 30.58,36.58 | v32.99,34.16 32.99,34.29 | v36.93,36.7 37.06,36.58 | v34.01,31.75 34.01,32 | v4.99,33.85 4.29,33.85 | v12.17,102.23 12.17,102.11 | 15.97,103.38 v16.1,103.5 | v21.31,101.6 21.31,101.85 | v21.56,99.82 21.56,99.95 | v23.09,104.14 23.47,104.01 | v12.29,92.71 12.29,92.33 | v22.96,85.47 22.96,85.72 | v20.42,85.47 20.42,85.6 | v17.24,68.07 17.37,67.94 | v18.52,68.07 18.64,67.94 | v19.78,68.07 19.91,68.07 | v19.78,73.28 19.91,73.15 | v13.05,47.12 13.18,47.24 | v10.89,44.2 11.02,44.2 | v25.5,44.83 25.63,44.83 | v26.13,32.38 26.77,32.38 | v31.91,32.19 31.91,32.26 | v6.83,3.43 7.09,3.43 | v5.05,11.43 5.31,11.43
  pour Bottom: -1.17,109.22 -1.17,-2.54 40.74,-2.54 40.74,109.22
KNOB_FREQ  (via drill 0.3)
  Top 0.203: v29.33,48.75 v25.33,52.75 | v30.58,47.5 31.08,47.5 31.83,46.75 R17.P$2 | 10.08,60.88 R30.2 9.96,60.93 v9.96,59.62
  Bottom 0.203: v25.33,52.75 20.7,57.38 13.58,57.38 12.21,57.38 v9.96,59.62 | v30.58,47.5 v29.33,48.75
KNOB_MOD  (via drill 0.3)
  Top 0.203: v17.58,71.88 12.46,71.88 R27.2 | v25.95,63.5 30.33,63.5 31.83,62 R69.P$2
  Bottom 0.203: v25.95,63.5 v17.58,71.88
KNOB_PHASE  (via drill 0.3)
  Top 0.203: v8.58,93.75 8.58,92.75 R43.2 | v8.83,96.25 8.83,100.62 9.83,101.62 17.33,101.62 19.83,104.12 21.83,104.12 v21.95,104.25 | v23.45,102.75 26.45,102.75 v32.08,97.12 | v31.83,94 31.83,92.38 R42.P$2
  Bottom 0.203: v8.58,93.75 8.58,94.88 8.83,95.12 v8.83,96.25 | v23.45,102.75 v21.95,104.25 | v32.08,97.12 32.08,94.25 v31.83,94
KNOB_SHAPE
  Top 0.203: R68.P$2 31.69,77.12 29.95,78.87 27.66,78.87 R23.2
LATCH  (via drill 0.3)
  Top 0.203: U4.12 23.21,46.86 v22.83,47.24 | U1.19 20.08,96.2 v21.56,96.2 | v26.45,96.33 26.64,96.52 36.3,96.52 38.45,94.36 38.45,62 v35.2,58.75 | v8.21,46.62 8.58,46.25 8.58,45.75 U5.12 | v9.58,48 13.08,48 13.83,47.25 13.83,45.12 14.08,44.88 16.58,44.88 v17.83,46.12 | v24.7,49.62 24.7,53.38 27.94,56.61 v33.07,56.61
  Bottom 0.203: v21.56,96.2 21.69,96.33 v26.45,96.33 | v9.58,48 v8.21,46.62 | v17.83,46.12 21.83,46.12 22.83,47.12 v22.83,47.24 22.95,47.25 22.95,47.88 v24.7,49.62 | v35.2,58.75 v33.07,56.61
N$1  (via drill 0.3)
  Top 0.203: v25.08,38 23.83,38 23.45,38.38 23.45,39.12 19.83,42.75 19.83,45.62 20.45,46.25 21.7,46.25 U4.15 | v26.45,39.38 26.83,39.38 27.33,38.88 R33.2
  Bottom 0.203: v26.45,39.38 v25.08,38
N$2  (via drill 0.3)
  Top 0.203: R6.1 20.8,49.02 20.8,49.88 | 20.8,49.88 IC3.6 | v16.95,46.5 16.2,45.75 R4.2 | v19.33,48.5 20.7,49.88 20.8,49.88
  Bottom 0.203: v16.95,46.5 16.95,47.25 18.2,48.5 v19.33,48.5
N$3
  Top 0.203: R16.2 6.45,88.39 J2.TIP@3
N$4  (via drill 0.3)
  Top 0.203: R15.1 16.23,64.96 C15.1 R12.2 16.1,67.69 16.03,67.77 IC4.9 15.96,69.62 15.71,69.88 v15.71,71.25 18.33,71.25 19.08,72 v22.45,72 | v5.58,84 2.58,87 2.58,90.75 R16.1 | v11.96,77.62 v6.96,82.62 | v13.21,75.25 v13.21,76.38 | v25.2,74.75 25.2,74.88 26.2,75.88 R23.1
  Bottom 0.203: v6.96,82.62 v5.58,84 | v13.21,76.38 v11.96,77.62 | v13.21,75.25 15.71,72.75 v15.71,71.25 | v22.45,72 v25.2,74.75
N$5
  Top 0.203: R9.2 24.23,81.79 U7.8
N$6
  Top 0.203: J3.TIP@3 6.51,73.14 R1.2
N$7
  Top 0.203: R7.2 21.7,82.43 U7.6
N$8
  Top 0.203: R1.1 8.24,75.77 R3.1 10.33,75.7 10.33,74 10.96,73.37 R27.1 12.46,73.25 18.83,73.25 19.45,72.62 20.08,72.62 20.95,73.5 20.95,73.75 IC4.2 21.11,73.84 21.05,73.79 21.05,76.33 21.18,76.45 21.18,77.41 R2.2 C1.1
N$9  (via drill 0.3)
  Top 0.203: v19.66,61.59 19.34,61.28 R5.2 C2.1 16.1,58.8 15.72,58.42 IC3.13 15.72,55.52 15.46,55.25 13.21,55.25 12.71,55.75 12.71,56.74 R37.1 | v20.8,62.55 21.56,63.31 23.47,63.31 24.04,63.88 v24.04,78.36 | v24.04,79.69 22.7,81.03 R9.1
  Bottom 0.203: v19.66,61.59 20.61,62.55 v20.8,62.55 | v24.04,78.36 v24.04,79.69
N$10  (via drill 0.3)
  Top 0.203: R8.2 C3.1 16.1,49.73 15.83,50 15.83,51.52 IC3.2 15.72,52.96 15.92,53.16 | 15.92,53.16 16.23,53.47 23.91,53.47 24.67,54.23 24.61,75.18 24.61,75.25 v24.93,75.56 | v21.18,80.26 19.67,81.78 R7.1 | R36.1 13.38,50.93 13.71,51.25 13.71,53 14.21,53.5 15.58,53.5 15.92,53.16
  Bottom 0.203: v24.93,75.56 21.18,79.31 v21.18,80.26
N$11
  Top 0.203: J4.TIP@3 6.45,99.12 2.51,95.18 R11.2
N$12  (via drill 0.3)
  Top 0.203: R11.1 R43.1 7.08,92.62 v7.08,90.5 | IC4.6 16.03,76.25 16.36,76.58 16.36,77.41 R13.2 C9.1 16.41,80.44 R41.1 16.33,80.5 v16.33,81.5 | v14.21,83.38 v10.33,87.25
  Bottom 0.203: v10.33,87.25 v7.08,90.5 | v14.21,83.38 14.46,83.38 v16.33,81.5
N$13
  Top 0.381: D1.1 1.37,13.21 6.45,18.29 6.45,19.18 9.75,22.48 9.75,27.18 11.02,28.45 J14.9 J14.10
N$14  (via drill 0.3)
  Top 0.203: R6.2 22.07,49.28 IC3.7 22.08,51.38 25.33,48.12 v33.7,48.12 | v35.08,48.12 38.58,44.62 38.58,35.23 37.58,34.23 37.58,32.48 37.83,32.23 37.83,12.99 R24.2
  Bottom 0.203: v33.7,48.12 v35.08,48.12
N$15  (via drill 0.3)
  Top 0.203: Q1.B 3.97,35.75 2.89,34.67 2.89,33.59 v1.81,32.51 | v1.37,26.86 1.37,25.46 R18.2
  Bottom 0.203: v1.81,32.51 1.81,27.3 v1.37,26.86
N$16
  Top 0.203: R18.1 4.22,25.15 J5.TIP@3
N$17
  Top 0.203: IC3.9 20.8,58.55 20.93,58.67 R52.1 20.93,61.28 19.28,62.93 16.16,62.93 R53.2
N$18
  Top 0.203: IC3.1 14.58,51.5 C3.2 R8.1 R4.1
N$19
  Top 0.203: U4.1 21.2,44.75 21.2,42.38 22.95,40.62 28.95,40.62 R32.2
N$20
  Top 0.203: J13.TIP@3 21.11,10.21 R25.1
N$21
  Top 0.203: J12.TIP@3 33.53,10.21 R24.1
N$22
  Top 0.203: U5.15 6.96,45.62 2.8,45.62 2.08,44.91 2.08,38.88 R59.2
N$23
  Top 0.203: D40.- 20.55,26.04 R10.1
N$24
  Top 0.203: IC3.14 14.45,58.42 14.58,58.55 C2.2 R5.1 R53.1
N$25
  Top 0.203: R21.2 25.97,28.43 25.97,29.34 Q3.B
N$26
  Top 0.203: U4.2 21.7,43.88 21.7,42.49 23.05,41.15 25.75,41.15 25.83,41.12 26.2,41.5 30.95,41.5 33.58,38.88 R31.2
N$27
  Top 0.203: R35.1 30.83,27.43 D3.-
N$28
  Top 0.203: D28.+ R62.1
N$29  (via drill 0.3)
  Top 0.203: 18.33,22.91 J7.TIP@3 19.2,22.91 v21.05,24.77 | v22.96,27.3 22.96,29.87 Q3.C 24.23,30.95 R19.1
  Bottom 0.203: v22.96,27.3 21.05,25.4 v21.05,24.77
N$30
  Top 0.203: U5.1 6.58,44.12 R58.2
N$31
  Top 0.203: U5.2 7.08,41.25 8.33,40 8.33,38.88 R56.2
N$32
  Top 0.203: D29.+ 17.59,38.86 R61.1
N$33
  Top 0.203: J1.TIP@3 5.01,59.28 R14.2
N$34
  Top 0.203: R14.1 R30.1 8.46,62.27 10.2,64.01 18.52,64.01 R28.1 19.59,65.09 C16.1 R22.2 21.11,66.81 IC4.13
N$35
  Top 0.203: U5.3 7.58,43.25 7.58,42.38 9.46,40.5 9.96,40.5 R57.2
N$36
  Top 0.203: U4.3 22.2,43.88 22.2,42.61 23.16,41.66 24.23,41.66 24.33,41.62 24.7,41.62 25.08,42 31.08,42 32.33,40.75 35.45,40.75 R34.2
N$37
  Top 0.203: U5.4 8.08,43.25 8.08,42.5 9.21,41.38 12.08,41.38 14.58,38.88 R62.2
N$38
  Top 0.203: U5.5 8.58,42.62 9.33,41.88 14.58,41.88 15.96,40.5 R61.2
N$39
  Top 0.203: U5.6 9.08,42.75 9.54,42.29 15.34,42.29 16.1,41.53 18.77,41.53 20.83,39.47 R63.2 20.7,39.38
N$40
  Top 0.203: U5.7 9.58,43.25 10.03,42.8 16.48,42.8 16.75,42.53 R64.2
N$60
  Top 0.203: Q5.B 28.74,29.53 28.55,29.72 28.55,30.19 R40.2
N$61  (via drill 0.3)
  Top 0.203: J6.TIP@3 31.85,23.37 v33.5,25.02 | v33.44,26.8 33.44,29.15 32.99,29.59 32.99,30.16 32.74,30.42 29.8,30.42 Q5.C 29.73,32.59 R39.1
  Bottom 0.203: v33.5,25.02 33.5,26.73 v33.44,26.8
N$64
  Top 0.381: J14.2 J14.1 21.08,29.12 19.7,27.75 17.38,27.75 15.76,26.12 15.71,26.12 D2.2
N$73
  Top 0.203: D27.+ 11.59,38.86 R57.1
N$74
  Top 0.203: D26.+ R56.1
N$75
  Top 0.203: D25.+ arc-90 5.07,38.97 R58.1
N$76
  Top 0.203: D24.+ R59.1
N$77
  Top 0.203: D30.+ arc-90 20.83,35.91 R63.1
N$78
  Top 0.203: D31.+ 23.33,37.34 22.33,38.34 22.33,39.62 19.42,42.53 R64.1
N$79
  Top 0.203: D32.+ R33.1
N$80
  Top 0.203: D33.+ arc90 30.59,38.87 R32.1
N$81
  Top 0.203: D34.+ arc-90 33.62,35.82 R31.1
N$82
  Top 0.203: D35.+ arc90 37.06,38.99 R34.1
N$94  (via drill 0.3)  (1 unrouted)
  Top 0.203: 22.33,59.62 22.33,57.12 22.08,56.88 IC3.8 | v36.08,26.12 36.08,23.5 28.7,16.12 28.58,16 24.95,12.37 R25.2 | v33.95,40.12 35.08,39 35.08,35.51 36.17,34.42 36.17,32.51 35.41,31.75 35.41,27.45 v35.08,27.12 | R52.2 22.58,59.56 v23.85,59.56 | v26.26,59.56 32.74,59.56 33.88,58.42 33.88,56.13 32.99,55.24 32.99,51.31 33.63,50.67 v33.63,50.16 | v33.98,41.5 36.67,44.2 v36.68,44.2
  Bottom 0.203: v35.08,27.12 v36.08,26.12 | v33.98,41.5 v33.95,40.12 | v23.85,59.56 v26.26,59.56 | v33.63,50.16 33.75,50.04 35.41,50.04 36.8,48.64 36.8,44.32 v36.68,44.2
OUT_LFOCYCLEMID  (via drill 0.3)
  Top 0.203: R10.2 25.12,26.16 R21.1 25.12,28.19 24.67,28.64 24.67,32.13 25.25,32.7 25.25,33.47 25.33,33.5 v25.33,37.12 | v24.45,42.25 23.7,43 23.58,43 23.2,43.38 23.2,43.88 U4.5
  Bottom 0.203: v24.45,42.25 27.08,39.62 27.08,38.88 v25.33,37.12
OUT_LFOCYCLESTART  (via drill 0.3)
  Top 0.203: U4.4 22.71,42.93 23.34,42.29 v23.47,42.29 | v23.59,40.01 24.99,40.01 26.01,38.99 26.01,33.91 26.9,33.02 26.9,30.32 R40.1 27.91,29.3 R35.2
  Bottom 0.203: v23.47,42.29 23.59,42.16 v23.59,40.01
PTA6  (via drill 0.3)
  Top 0.203: U1.8 17.56,89.79 v18.13,89.22
  Bottom 0.203: v18.13,89.22 18.1,89.18 TP1.TP
REF_-5V  (via drill 0.3)
  Top 0.203: U2.2 12.25,104.68 C6.2 9.01,104.5 8.61,104.9 4.67,104.9 1.37,101.6 1.37,80.14 4.54,76.96 | U2.2 16.37,104.68 | 4.54,76.96 11.15,76.96 | 11.15,76.96 11.78,76.33 R3.2 11.83,75.75 v13.71,73.88 | 11.15,76.96 12.8,76.96 13.31,77.47 13.31,79.76 14.01,80.45 R41.2 | R26.2 17.26,104.68 U2.2 | R15.2 R28.2 19.58,66.5 19.58,67 20.45,67.88 20.45,70.75 v19.95,71.25 | v15.08,72.5 v18.7,72.5 | 4.54,76.96 4.42,76.96 3.83,76.38 3.83,71.25 4.83,70.25 4.83,67 3.83,66 3.83,57.5 4.96,56.38 8.08,56.38 v9.58,57.88 10,58.29 R37.2 | R36.2 12.67,53.41 v12.46,53.62
  Bottom 0.203: v18.7,72.5 v19.95,71.25 | v13.71,73.88 v15.08,72.5 | v12.46,53.62 12.46,55 v9.58,57.88
RESET_PATTERN  (via drill 0.3)
  Top 0.203: R20.1 24.01,92.25 23.58,92.25 | 23.58,92.25 U1.13 | v24.08,56.38 v21.83,54.12 | v25.33,57.62 25.33,73.75 27.95,76.38 v27.95,78.25 | v25.7,80.5 25.7,82.88 25.08,83.5 v25.08,89.88 | 23.58,92.25 v23.58,91.38 | v7.46,39.75 7.46,35.97 Q1.C
  Bottom 0.203: v21.83,54.12 v7.46,39.75 | v25.33,57.62 v24.08,56.38 | v25.7,80.5 v27.95,78.25 | v23.58,91.38 v25.08,89.88
SCL  (via drill 0.3)
  Top 0.203: R50.2 19.71,98.95 U6.1 20.67,97.66 v20.93,97.66 | v23.59,97.85 23.21,97.66 23.21,95.12 22.35,94.26 U1.17
  Bottom 0.203: v20.93,97.66 23.59,97.66 v23.59,97.85
SDA
  Top 0.203: R51.2 23.09,99.48 U6.3 22.58,98.93 22.58,95.25 22.07,94.75 U1.18
SHIFTER1TO2
  Top 0.203: U5.9 10.39,44.7 10.64,44.96 11.15,44.96 12.29,43.81 17.88,43.81 19.02,44.96 19.02,45.59 20.8,47.37 21.94,47.37 22.2,47.12 U4.14
SHIFTERS  (via drill 0.3)
  Top 0.203: U1.2 14.49,94.26 13.94,94.81 13.94,95.95 12.48,97.41 11.97,97.41 9.69,95.12 9.69,87.19 3.72,81.22 3.72,79.76 v3.21,79.25 | v2.26,78.3 1.37,77.41 1.37,59.59 v2.21,58.75 | v0.86,57.47 0.86,49.97 3.21,47.62 4.93,47.62 v4.99,47.69 | v6.89,46.67 7.21,46.67 7.53,46.35 7.53,45.67 U5.14
  Bottom 0.203: v3.21,79.25 v2.26,78.3 | v4.99,47.69 5.88,47.69 v6.89,46.67 | v2.21,58.75 2.14,58.75 v0.86,57.47
SWD_CLK  (via drill 0.3)
  Top 0.203: v13.58,97.88 17.33,97.88 18.08,97.12 18.08,95.75 U1.22 | v12.33,95.25 v12.33,96.62
  Bottom 0.203: v12.33,96.62 v13.58,97.88 | v12.33,95.25 12.33,94.38 11.33,93.38 10.58,93.38 SWD1.4
SWD_DIO  (via drill 0.3)
  Top 0.203: v14.58,96.88 15.71,95.75 17.08,95.75 U1.24
  Bottom 0.203: v14.58,96.88 13.58,96.88 12.58,95.88 11.83,95.88 10.58,94.62 SWD1.2